# Altium schematic sheet NE555.SchDoc
size A4; SheetNumber: 1; SheetTotal: 1
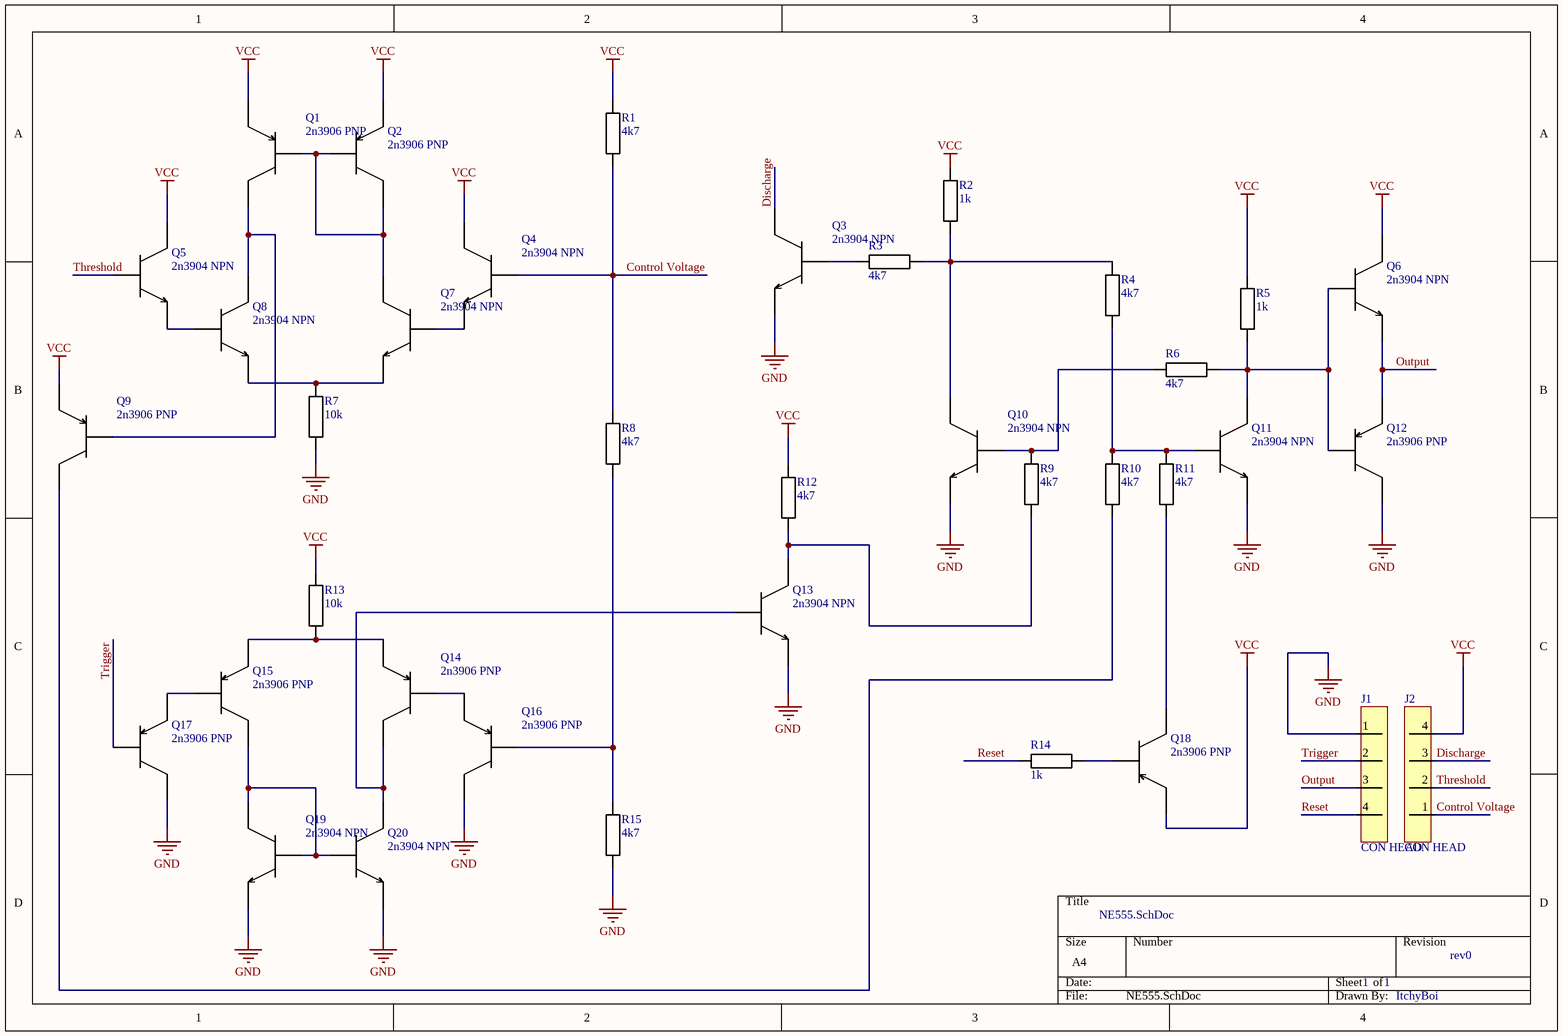
[diagram p0: NE555.SchDoc]

## Parts
J1  CON HEAD  [SMT 4 HEADER 2.54]
J2  CON HEAD  [SMT 4 HEADER 2.54]
Q1  2n3906 PNP  [SOT95P240X110-3N]
Q2  2n3906 PNP  [SOT95P240X110-3N]
Q3  2n3904 NPN  [SOT95P240X110-3N]
Q4  2n3904 NPN  [SOT95P240X110-3N]
Q5  2n3904 NPN  [SOT95P240X110-3N]
Q6  2n3904 NPN  [SOT95P240X110-3N]
Q7  2n3904 NPN  [SOT95P240X110-3N]
Q8  2n3904 NPN  [SOT95P240X110-3N]
Q9  2n3906 PNP  [SOT95P240X110-3N]
Q10  2n3904 NPN  [SOT95P240X110-3N]
Q11  2n3904 NPN  [SOT95P240X110-3N]
Q12  2n3906 PNP  [SOT95P240X110-3N]
Q13  2n3904 NPN  [SOT95P240X110-3N]
Q14  2n3906 PNP  [SOT95P240X110-3N]
Q15  2n3906 PNP  [SOT95P240X110-3N]
Q16  2n3906 PNP  [SOT95P240X110-3N]
Q17  2n3906 PNP  [SOT95P240X110-3N]
Q18  2n3906 PNP  [SOT95P240X110-3N]
Q19  2n3904 NPN  [SOT95P240X110-3N]
Q20  2n3904 NPN  [SOT95P240X110-3N]
R1  4k7  [R0805]
R2  1k  [R0805]
R3  4k7  [R0805]
R4  4k7  [R0805]
R5  1k  [R0805]
R6  4k7  [R0805]
R7  10k  [R0805]
R8  4k7  [R0805]
R9  4k7  [R0805]
R10  4k7  [R0805]
R11  4k7  [R0805]
R12  4k7  [R0805]
R13  10k  [R0805]
R14  1k  [R0805]
R15  4k7  [R0805]

## Nets
GND: J1.1 Q3.2(E) Q10.2(E) Q11.2(E) Q12.3(C) Q13.2(E) Q16.3(C) Q17.3(C) Q19.2(E) Q20.2(E) R7.1 R15.2
VCC: J2.4 Q1.2(E) Q2.2(E) Q4.3(C) Q5.3(C) Q6.3(C) Q9.2(E) Q18.2(E) R1.1 R2.2 R5.2 R12.1 R13.2
Control Voltage: J2.1 Q4.1(B) R1.2 R8.1
Discharge: J2.3 Q3.3(C)
Output: J1.3 Q6.2(E) Q12.2(E)
Reset: J1.4 R14.2
Threshold: J2.2 Q5.1(B)
Trigger: J1.2 Q17.1(B)
NetQ1_1: Q1.1(B) Q2.1(B) Q2.3(C) Q7.3(C)
NetQ1_3: Q1.3(C) Q8.3(C) Q9.1(B)
NetQ3_1: Q3.1(B) R3.2
NetQ4_2: Q4.2(E) Q7.1(B)
NetQ5_2: Q5.2(E) Q8.1(B)
NetQ6_1: Q6.1(B) Q11.3(C) Q12.1(B) R5.1 R6.2
NetQ7_2: Q7.2(E) Q8.2(E) R7.2
NetQ9_3: Q9.3(C) R10.1
NetQ10_1: Q10.1(B) R6.1 R9.2
NetQ10_3: Q10.3(C) R2.1 R3.1 R4.2
NetQ11_1: Q11.1(B) R4.1 R10.2 R11.1
NetQ13_1: Q13.1(B) Q14.3(C) Q20.3(C)
NetQ13_3: Q13.3(C) R9.1 R12.2
NetQ14_1: Q14.1(B) Q16.2(E)
NetQ14_2: Q14.2(E) Q15.2(E) R13.1
NetQ15_1: Q15.1(B) Q17.2(E)
NetQ15_3: Q15.3(C) Q19.1(B) Q19.3(C) Q20.1(B)
NetQ16_1: Q16.1(B) R8.2 R15.1
NetQ18_1: Q18.1(B) R14.1
NetQ18_3: Q18.3(C) R11.2

## Notes on the sheet
- rev0
- ItchyBoi

## Library data of the parts
J1 J2 = 0878980426: CONN HEADER 4POS VERT 2.54MM SMD; Manufacturer: Molex; Number of Positions: 4; Connector Type: Male Pin; Supplier 1: Digi-Key; Manufacturer Part Number: 0878980426; RoHS: Yes; Category: Headers and Wire Housings; Stock 1: 12884; Pricing 1: 1=0,70000, 10=0,58800, 100=0,45700, 1000=0,35904, 5000=0,31552, 10000=0,29376 (USD); Mount: Surface Mount; Contact Plating: Tin; Housing Material: Nylon; Contact Material: Copper Alloy; Color: Black; Housing Color: Black; Min Operating Temperature: -55°C; Max Operating Temperature: 105°C; Number of Rows: 1; Packaging: Rail/Tube; Termination: Solder; Number of Contacts: 4; Orientation: Straight; Length: 10.16mm; Pitch: 2.54mm; Contact Mating Length: 0.23inch; Depth: 2.49mm; Radiation Hardening: No; ComponentLink1URL: http://components.arrow.com/part/dataview/0323_02947488?src-supplier=Arrow+Europe; ComponentLink1Description: http://components.arrow.com/part/dataview/0323_02947488?src-supplier=Arrow+Europe; ComponentLink2URL: http://components.arrow.com/part/dataview/46509697S8733290N3303?src-supplier=Arrow+Electronics; ComponentLink2Description: http://components.arrow.com/part/dataview/46509697S8733290N3303?src-supplier=Arrow+Electronics; ComponentLink3URL: https://www.molex.com/pdm_docs/sd/878980426_sd.pdf?src-supplier=Digi-Key; ComponentLink3Description: https://www.molex.com/pdm_docs/sd/878980426_sd.pdf?src-supplier=Digi-Key; Supplier Part Number 1: WM8617-ND
Q1 Q2 Q9 Q12 Q14-Q18 = MMBT3906: TRANS PNP 40V 0.2A SOT-23; Manufacturer: ON Semiconductor / Fairchild; Max Collector Current: 200mA; Transition Frequency: 250MHz; Collector Base Voltage (VCBO): -40V; Emitter Base Voltage (VEBO): -5V; Collector Emitter Saturation Voltage: -400mV; Power Dissipation: 350mW; Number of Elements: 1; hFE Min: 100; Element Configuration: Single; Current Rating: -200mA; Supplier 1: Farnell; Manufacturer Part Number: MMBT3906; RoHS: Yes; Category: BJTs; Pricing 1: 5=0,13300, 25=0,09010, 100=0,04710, 250=0,03920, 500=0,03140, 1000=0,02350, 5000=0,02300 (GBP); Mount: Surface Mount; Case/Package: SOT-23; Number of Pins: 3; Weight: 0.03g; Min Operating Temperature: -55°C; Max Operating Temperature: 150°C; Collector Emitter Breakdown Voltage: 40V; Polarity: PNP; Frequency: 250MHz; Packaging: Tape and Reel; Max Power Dissipation: 350mW; Package Quantity: 1; Collector Emitter Voltage (VCEO): 40V; Gain Bandwidth Product: 250MHz; Max Breakdown Voltage: 40V; Max Frequency: 250MHz; Voltage Rating (DC): -40V; Length: 0.25inch; Width: 0.25inch; Height: 0.25inch; Radiation Hardening: No; Lead Free: Lead Free; REACH SVHC: No SVHC; ComponentLink1URL: https://datasheet.ciiva.com/971/2n3906-971895.pdf?src-supplier=Digi-Key; ComponentLink1Description: https://datasheet.ciiva.com/971/2n3906-971895.pdf?src-supplier=Digi-Key; ComponentLink2URL: https://datasheet.ciiva.com/971/2n3906-971896.pdf?src-supplier=Digi-Key; ComponentLink2Description: https://datasheet.ciiva.com/971/2n3906-971896.pdf?src-supplier=Digi-Key; ComponentLink3URL: https://datasheet.ciiva.com/971/2n3906-971897.pdf?src-supplier=Digi-Key; ComponentLink3Description: https://datasheet.ciiva.com/971/2n3906-971897.pdf?src-supplier=Digi-Key; ComponentLink4URL: https://datasheet.ciiva.com/17081/mmbt3906-17081676.pdf?src-supplier=Future+Electronics; ComponentLink4Description: https://datasheet.ciiva.com/17081/mmbt3906-17081676.pdf?src-supplier=Future+Electronics; ComponentLink5URL: https://datasheet.ciiva.com/26237/mmbt3906-26237241.pdf?src-supplier=Avnet+Europe; ComponentLink5Description: https://datasheet.ciiva.com/26237/mmbt3906-26237241.pdf?src-supplier=Avnet+Europe; ComponentLink6URL: https://datasheet.ciiva.com/22653/1817590-22653485.pdf?src-supplier=Element14; ComponentLink6Description: https://datasheet.ciiva.com/22653/1817590-22653485.pdf?src-supplier=Element14; ComponentLink7URL: https://datasheet.ciiva.com/7972/1817590-7972670.pdf?src-supplier=Element14; ComponentLink7Description: https://datasheet.ciiva.com/7972/1817590-7972670.pdf?src-supplier=Element14; Supplier Part Number 1: 9846832
Q3-Q8 Q10 Q11 Q13 Q19 Q20 = MMBT3904: Trans Gp Bjt NPN 40V 0.2A 3-PIN SOT-23 T/r Trans Gp Bjt NPN 40V 0.2A 3-PIN SOT-23 T/r; Manufacturer: ON Semiconductor / Fairchild; Max Power Dissipation: 350mW; Max Collector Current: 200mA; Collector Base Voltage (VCBO): 60V; Element Configuration: Single; Emitter Base Voltage (VEBO): 6V; Transition Frequency: 300MHz; hFE Min: 100; Collector Emitter Saturation Voltage: 300mV; Number of Elements: 1; Supplier 1: Farnell; Manufacturer Part Number: MMBT3904; RoHS: Yes; Category: BJTs; Stock 1: 2182; Pricing 1: 5=0,13600, 25=0,13300, 100=0,04760, 250=0,04350, 500=0,04300, 1000=0,02200, 5000=0,02000 (GBP); Mount: Surface Mount; Case/Package: SOT-23; Number of Pins: 3; Weight: 0.03g; Contact Plating: Tin,Matte; Min Operating Temperature: -55°C; Max Operating Temperature: 150°C; Collector Emitter Voltage (VCEO): 40V; Polarity: NPN; Collector Emitter Breakdown Voltage: 40V; Packaging: Tape and Reel; Power Dissipation: 350mW; Package Quantity: 1; Voltage Rating (DC): 40V; Gain Bandwidth Product: 300MHz; Current Rating: 200mA; Frequency: 300MHz; Max Frequency: 300MHz; Max Breakdown Voltage: 40V; Termination: SMD/SMT; Length: 0.25inch; Width: 0.25inch; Height: 0.25inch; Radiation Hardening: No; Lead Free: Lead Free; REACH SVHC: No SVHC; ComponentLink1URL: https://datasheet.ciiva.com/971/mmbt3904-971892.pdf?src-supplier=Digi-Key; ComponentLink1Description: https://datasheet.ciiva.com/971/mmbt3904-971892.pdf?src-supplier=Digi-Key; ComponentLink2URL: https://datasheet.ciiva.com/971/mmbt3904-971893.pdf?src-supplier=Digi-Key; ComponentLink2Description: https://datasheet.ciiva.com/971/mmbt3904-971893.pdf?src-supplier=Digi-Key; ComponentLink3URL: https://datasheet.ciiva.com/22653/1922793-22653482.pdf?src-supplier=Element14; ComponentLink3Description: https://datasheet.ciiva.com/22653/1922793-22653482.pdf?src-supplier=Element14; ComponentLink4URL: https://datasheet.ciiva.com/971/mmbt3904-971891.pdf?src-supplier=Digi-Key; ComponentLink4Description: https://datasheet.ciiva.com/971/mmbt3904-971891.pdf?src-supplier=Digi-Key; ComponentLink5URL: https://datasheet.ciiva.com/26237/mmbt3904-26237242.pdf?src-supplier=Avnet+Europe; ComponentLink5Description: https://datasheet.ciiva.com/26237/mmbt3904-26237242.pdf?src-supplier=Avnet+Europe; ComponentLink6URL: https://datasheet.ciiva.com/7972/2n3904-7972669.pdf?src-supplier=Element14; ComponentLink6Description: https://datasheet.ciiva.com/7972/2n3904-7972669.pdf?src-supplier=Element14; ComponentLink7URL: https://datasheet.ciiva.com/16850/mmbt3904-16850397.pdf?src-supplier=Future+Electronics; ComponentLink7Description: https://datasheet.ciiva.com/16850/mmbt3904-16850397.pdf?src-supplier=Future+Electronics; ComponentLink8URL: https://datasheet.ciiva.com/11201/mmbt3904-11201775.pdf?src-supplier=Avnet; ComponentLink8Description: https://datasheet.ciiva.com/11201/mmbt3904-11201775.pdf?src-supplier=Avnet; Supplier Part Number 1: 9846727
R1 R3 R4 R6 R8-R12 R15 = CRCW08054K70FKEA: VISHAY - CRCW08054K70FKEA - Resistencia SMD de Tipo Chip, Película Gruesa, 0805 [Métrica 2012], 4.7 kohm, Serie CRCW, 150 V; Resistance: 4.7kR; Tolerance: 1%; Temperature Coefficient: 100ppm/°C; Power Rating: 125mW; Voltage Rating: 150V; Supplier 1: Digi-Key; Manufacturer: Vishay; Manufacturer Part Number: CRCW08054K70FKEA; RoHS: Yes; Category: Chip SMD Resistors; Stock 1: 78446; Pricing 1: 1=0,10000, 10=0,05700, 100=0,02310, 1000=0,01039, 2500=0,00902 (USD); Case/Package: 0805; Contact Plating: Tin; Weight: 0.000194oz; Case Code (Imperial): 0805; Case Code (Metric): 2012; Min Operating Temperature: -55°C; Max Operating Temperature: 155°C; Resistor Type: Thick Film; Termination: SMD/SMT; Packaging: Tape and Reel; Package Quantity: 10; Voltage Rating (DC): 150V; Number of Terminations: 2; Max Power Dissipation: 125mW; Features: Automotive AEC-Q200; Length: 2mm; Width: 1.25mm; Height: 0.45mm; Depth: 1.25mm; Radiation Hardening: No; Lead Free: Lead Free; REACH SVHC: Unknown; Military Standard: Not; ComponentLink1URL: https://datasheet.ciiva.com/11808/0900766b80d98b26-11808992.pdf?src-supplier=RSComponents; ComponentLink1Description: https://datasheet.ciiva.com/11808/0900766b80d98b26-11808992.pdf?src-supplier=RSComponents; ComponentLink2URL: https://datasheet.ciiva.com/16213/dcrcwe3-16213733.pdf?src-supplier=Future+Electronics; ComponentLink2Description: https://datasheet.ciiva.com/16213/dcrcwe3-16213733.pdf?src-supplier=Future+Electronics; ComponentLink3URL: https://datasheet.ciiva.com/16720/70201119-16720438.pdf?src-supplier=Allied+Electronics; ComponentLink3Description: https://datasheet.ciiva.com/16720/70201119-16720438.pdf?src-supplier=Allied+Electronics; ComponentLink4URL: https://datasheet.ciiva.com/5550/dcrcwe3-109170-5550903.pdf?src-supplier=Mouser; ComponentLink4Description: https://datasheet.ciiva.com/5550/dcrcwe3-109170-5550903.pdf?src-supplier=Mouser; ComponentLink5URL: https://datasheet.ciiva.com/26317/fld-crcw-e3-data-en-26317145.pdf?src-supplier=Distrelec; ComponentLink5Description: https://datasheet.ciiva.com/26317/fld-crcw-e3-data-en-26317145.pdf?src-supplier=Distrelec; ComponentLink6URL: https://datasheet.ciiva.com/9071/dcrcwe3-9071196.pdf?src-supplier=Avnet; ComponentLink6Description: https://datasheet.ciiva.com/9071/dcrcwe3-9071196.pdf?src-supplier=Avnet; ComponentLink7URL: https://datasheet.ciiva.com/2467/dcrcwe3-2467437.pdf?src-supplier=Digi-Key; ComponentLink7Description: https://datasheet.ciiva.com/2467/dcrcwe3-2467437.pdf?src-supplier=Digi-Key; ComponentLink8URL: https://datasheet.ciiva.com/2467/dcrcwe3-2467438.pdf?src-supplier=Digi-Key; ComponentLink8Description: https://datasheet.ciiva.com/2467/dcrcwe3-2467438.pdf?src-supplier=Digi-Key; ComponentLink9URL: https://datasheet.ciiva.com/2467/dcrcwe3-2467439.pdf?src-supplier=Digi-Key; ComponentLink9Description: https://datasheet.ciiva.com/2467/dcrcwe3-2467439.pdf?src-supplier=Digi-Key; Supplier Part Number 1: 541-4.70KCCT-ND
R2 R5 R14 = CRCW08051K00FKEA: Res Thick Film 0805 1K Ohm 1% 0.125W(1/8W) ±100ppm/C Pad SMD Automotive T/R; Manufacturer: Vishay Dale; Resistance: 1kR; Temperature Coefficient: 100ppm/°C; Power Rating: 125mW; Voltage Rating: 150V; Supplier 1: Digi-Key; Manufacturer Part Number: CRCW08051K00FKEA; RoHS: Yes; Category: Chip SMD Resistors; Stock 1: 319183; Pricing 1: 1=0,10000, 10=0,05700, 100=0,02310, 1000=0,01039, 2500=0,00902 (USD); Case/Package: 0805; Number of Pins: 2; Contact Plating: Tin; Weight: 0.000194oz; Case Code (Imperial): 0805; Case Code (Metric): 2012; Min Operating Temperature: -55°C; Max Operating Temperature: 155°C; Tolerance: 1%; Resistor Type: Thick Film; Termination: SMD/SMT; Packaging: Tape and Reel; Package Quantity: 5000; Voltage Rating (DC): 150V; Length: 2mm; Width: 1.25mm; Height: 0.45mm; Depth: 1.25mm; Radiation Hardening: No; Lead Free: Lead Free; REACH SVHC: Unknown; Military Standard: Not; ComponentLink1URL: https://datasheet.ciiva.com/11808/0900766b80d98b26-11808530.pdf?src-supplier=RSComponents; ComponentLink1Description: https://datasheet.ciiva.com/11808/0900766b80d98b26-11808530.pdf?src-supplier=RSComponents; ComponentLink2URL: https://datasheet.ciiva.com/46381/1697337-46381606.pdf?src-supplier=Element14; ComponentLink2Description: https://datasheet.ciiva.com/46381/1697337-46381606.pdf?src-supplier=Element14; ComponentLink3URL: https://datasheet.ciiva.com/3258/dcrcwe3-3258215.pdf?src-supplier=Avnet; ComponentLink3Description: https://datasheet.ciiva.com/3258/dcrcwe3-3258215.pdf?src-supplier=Avnet; ComponentLink4URL: https://datasheet.ciiva.com/26312/fld-crcw-e3-data-en-26312922.pdf?src-supplier=Distrelec; ComponentLink4Description: https://datasheet.ciiva.com/26312/fld-crcw-e3-data-en-26312922.pdf?src-supplier=Distrelec; ComponentLink5URL: https://datasheet.ciiva.com/46441/1720486-46441626.pdf?src-supplier=Element14; ComponentLink5Description: https://datasheet.ciiva.com/46441/1720486-46441626.pdf?src-supplier=Element14; ComponentLink6URL: https://datasheet.ciiva.com/16213/dcrcwe3-16213643.pdf?src-supplier=Future+Electronics; ComponentLink6Description: https://datasheet.ciiva.com/16213/dcrcwe3-16213643.pdf?src-supplier=Future+Electronics; ComponentLink7URL: https://datasheet.ciiva.com/17204/dcrcwe3-17204396.pdf?src-supplier=Avnet+Europe; ComponentLink7Description: https://datasheet.ciiva.com/17204/dcrcwe3-17204396.pdf?src-supplier=Avnet+Europe; Supplier Part Number 1: 541-1.00KCCT-ND
R7 R13 = CRCW080510K0FKEA: VISHAY - CRCW080510K0FKEA - SMD Chip Resistor, 0805 [2012 Metric], 10 kohm, CRCW e3 Series, 150 V, Thick Film, 125 mW; Resistance: 10kR; Tolerance: 1%; Temperature Coefficient: 100ppm/°C; Power Rating: 125mW; Voltage Rating: 150V; Supplier 1: Digi-Key; Manufacturer: Vishay; Manufacturer Part Number: CRCW080510K0FKEA; RoHS: Yes; Category: Chip SMD Resistors; Stock 1: 111958; Pricing 1: 1=0,10000, 10=0,05700, 100=0,02310, 1000=0,01039, 2500=0,00902 (USD); Case/Package: 0805; Contact Plating: Tin; Weight: 0.000194oz; Case Code (Imperial): 0805; Case Code (Metric): 2012; Min Operating Temperature: -55°C; Max Operating Temperature: 155°C; Resistor Type: Thick Film; Packaging: Tape and Reel; Package Quantity: 5000; Termination: SMD/SMT; Voltage Rating (DC): 150V; Length: 2mm; Width: 1.25mm; Height: 0.45mm; Depth: 1.25mm; Radiation Hardening: No; Lead Free: Lead Free; REACH SVHC: Unknown; Military Standard: Not; ComponentLink1URL: https://datasheet.ciiva.com/11808/0900766b80d98b26-11808216.pdf?src-supplier=RSComponents; ComponentLink1Description: https://datasheet.ciiva.com/11808/0900766b80d98b26-11808216.pdf?src-supplier=RSComponents; ComponentLink2URL: https://datasheet.ciiva.com/5547/dcrcwe3-109170-5547559.pdf?src-supplier=Mouser; ComponentLink2Description: https://datasheet.ciiva.com/5547/dcrcwe3-109170-5547559.pdf?src-supplier=Mouser; ComponentLink3URL: https://datasheet.ciiva.com/16719/70201119-16719082.pdf?src-supplier=Allied+Electronics; ComponentLink3Description: https://datasheet.ciiva.com/16719/70201119-16719082.pdf?src-supplier=Allied+Electronics; ComponentLink4URL: https://datasheet.ciiva.com/16514/dcrcwe3-16514907.pdf?src-supplier=Avnet+Asia; ComponentLink4Description: https://datasheet.ciiva.com/16514/dcrcwe3-16514907.pdf?src-supplier=Avnet+Asia; ComponentLink5URL: https://datasheet.ciiva.com/16883/dcrcwe3-16883708.pdf?src-supplier=Avnet+Europe; ComponentLink5Description: https://datasheet.ciiva.com/16883/dcrcwe3-16883708.pdf?src-supplier=Avnet+Europe; ComponentLink6URL: https://datasheet.ciiva.com/8337/dcrcwe3-8337773.pdf?src-supplier=Avnet; ComponentLink6Description: https://datasheet.ciiva.com/8337/dcrcwe3-8337773.pdf?src-supplier=Avnet; ComponentLink7URL: https://datasheet.ciiva.com/16755/70201119-16755389.pdf?src-supplier=Allied+Electronics; ComponentLink7Description: https://datasheet.ciiva.com/16755/70201119-16755389.pdf?src-supplier=Allied+Electronics; ComponentLink8URL: https://datasheet.ciiva.com/46394/1720486-46394381.pdf?src-supplier=Element14; ComponentLink8Description: https://datasheet.ciiva.com/46394/1720486-46394381.pdf?src-supplier=Element14; ComponentLink9URL: https://datasheet.ciiva.com/8337/dcrcwe3-8337774.pdf?src-supplier=Avnet; ComponentLink9Description: https://datasheet.ciiva.com/8337/dcrcwe3-8337774.pdf?src-supplier=Avnet; ComponentLink10URL: https://datasheet.ciiva.com/16199/dcrcwe3-16199086.pdf?src-supplier=Future+Electronics; ComponentLink10Description: https://datasheet.ciiva.com/16199/dcrcwe3-16199086.pdf?src-supplier=Future+Electronics; Supplier Part Number 1: 541-10.0KCCT-ND